# EasyEDA Pro project 蓝牙小车.eprj

# Schematic Schematic1
Board Name: Board1; Create Date: 2025-12-05; Page Name: P1; Project Name: 蓝牙小车; Schematic Name: Schematic1; Update Date: 2026-01-07; Company: 嘉立创EDA; Page Size: A4; Version: V1.0
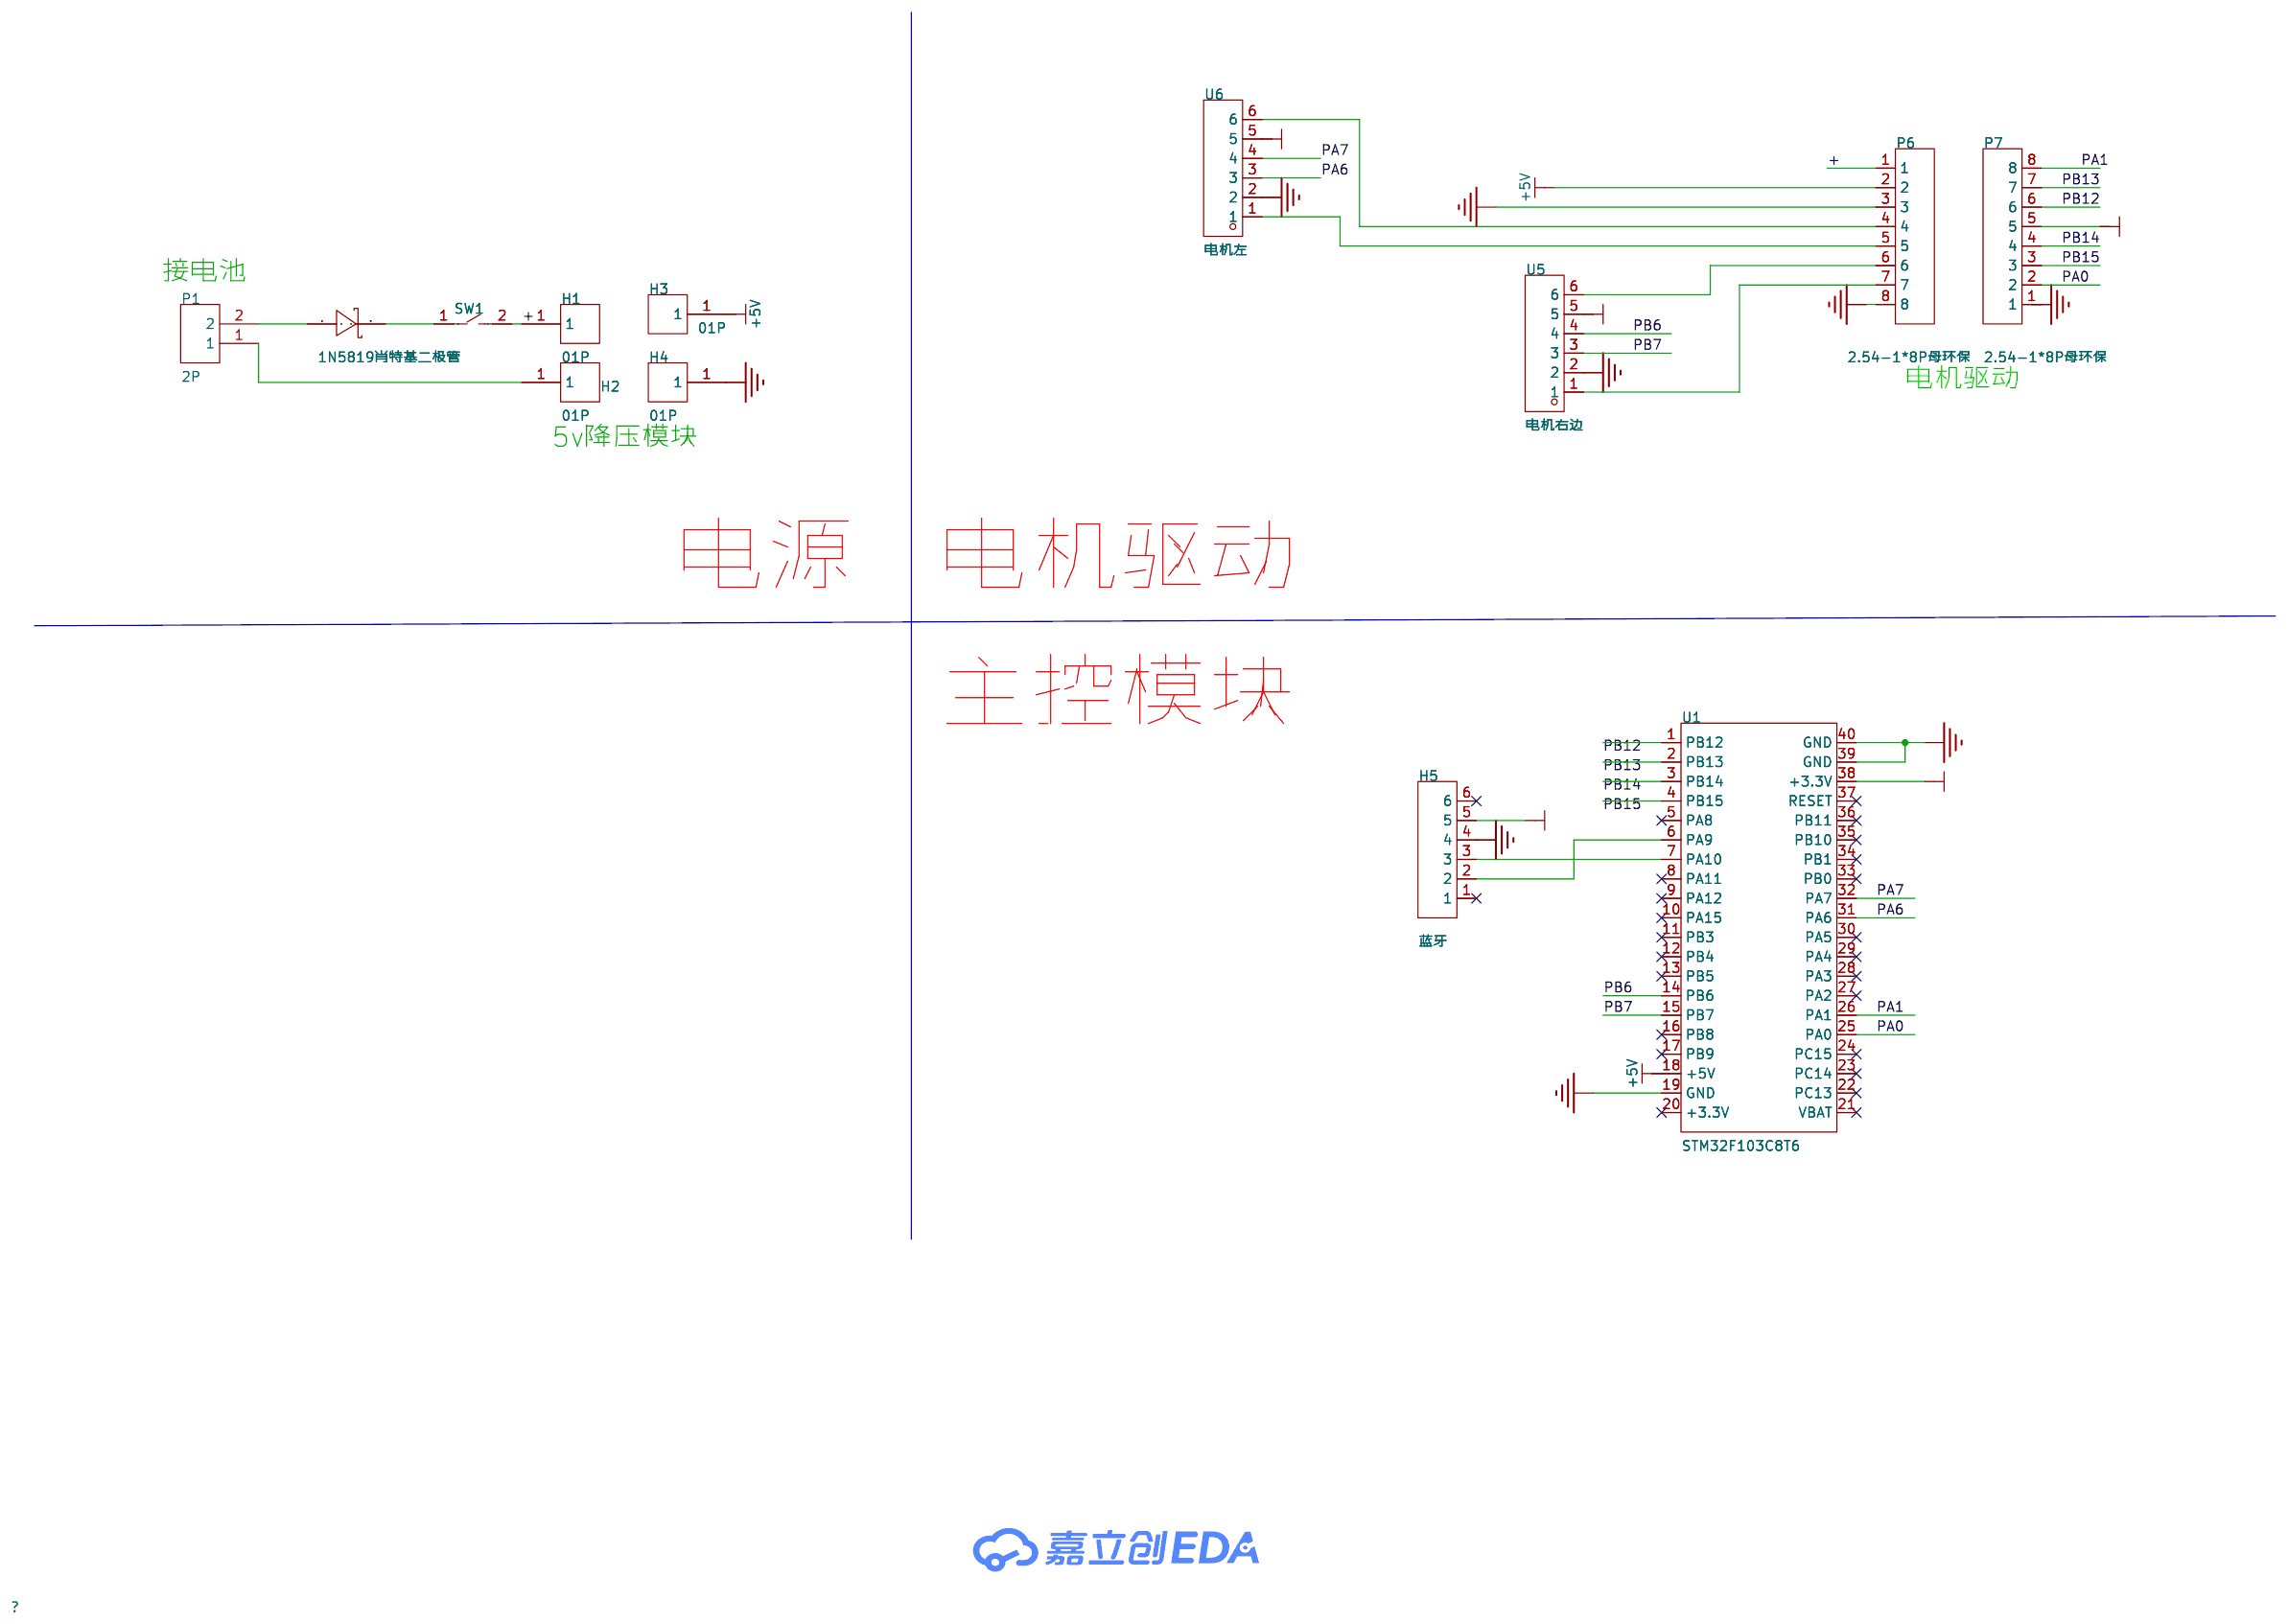
[diagram p0: schematic sheet]

## Parts
D1  1N5819肖特基二极管  [DO-41_BD2.4-L4.7-P8.70-D0.9-FD]
H1  01P  [HDR-TH_1P-P2.54-V-M]
H2  01P  [HDR-TH_1P-P2.54-V-M]
H3  01P  [HDR-TH_1P-P2.54-V-M]
H4  01P  [HDR-TH_1P-P2.54-V-M]
H5  蓝牙  [HDR-TH_6P-P2.54-H-F-W10.2]
P1  2P  [CONN-TH_2P-P5.00_WJ500V-5.08-2P]
P6  2.54-1*8P母环保  [HDR-TH_8P-P2.54-V-F_2]
P7  2.54-1*8P母环保  [HDR-TH_8P-P2.54-V-F_2]
SW1  HX KCD11-2P-R  [SW-TH_2P-L15.0-W10.5-P5.00_KCD11-2P-R]
U1  STM32F103C8T6  [CONN-TH_L53.3-W22.9_STM32F103C8T6-CARD]
U5  电机右边  [CONN-TH_6P-P2.50_ZX-XH2.54-6PWZ]
U6  电机左  [CONN-TH_6P-P2.50_ZX-XH2.54-6PWZ]

## Library data of the parts
D1 = 1N5819_C110032: LCSC Part Name: 电压:40V 电流:1A; Supplier Part: C110032; Manufacturer: ST(意法半导体); Supplier Footprint: DO-41; JLCPCB Part Class: 扩展库; Datasheet: https://item.szlcsc.com/datasheet/1N5819/111253.html; Supplier: LCSC; Voltage - Forward(Vf@If): 550mV@1A; Voltage - DC Reverse(Vr): 40V; Current - Rectified: 1A; Reverse Leakage Current (Ir): 500uA@40V; Non-Repetitive Peak Forward Surge Current: 25A
H1-H4 = PZ254V-11-01P: LCSC Part Name: 1x1P 间距:2.54mm 方针 直插; Supplier Part: C492400; Manufacturer: XFCN(兴飞); Supplier Footprint: 插件,P=2.54mm; JLCPCB Part Class: 扩展库; Datasheet: https://item.szlcsc.com/datasheet/PZ254V-11-01P/502956.html; Supplier: LCSC; Pin Structure: 1x1P; Pitch: 2.54mm; Circluar Pins/Square Pins: 方针; Mounting Type: 直插; Number of Rows: 单排; Number of Pins: 1P; Length of Mating Pin: 6mm; Insulation Height: 2.5mm; Length of End Connection Pin: 3mm; Contact Material: 黄铜; Operating Temperature: -40℃~+105℃; Color: 黑色
H5 = 2.54-1x6P WZPM: LCSC Part Name: 1x6P 间距:2.54mm 弯插; Supplier Part: C51018241; Manufacturer: SHOU HAN(首韩); Supplier Footprint: 弯插,P=2.54mm; JLCPCB Part Class: 扩展库; Datasheet: https://item.szlcsc.com/datasheet/2.54-1x6P%2520WZPM/53661126.html; Supplier: LCSC; Holes Structure: 1x6P; Pitch: 2.54mm; Circular Hole / Square Hole: 方孔; Mounting Type: 弯插; Number of Rows: 单排; Number of Positions: 6P; Current Rating: 3A; Holes Direction: 侧面; Contact Material: 黄铜; Contact Plating: 金; Operating Temperature: -40℃~+105℃
P1 = WJ500V-5.08-2P: LCSC Part Name: 1x2P 5.08mm 直插 排数:1 每排P数:2; Supplier Part: C8465; Manufacturer: KANGNEX(康奈克斯电气); Supplier Footprint: 插件,P=5.08mm; JLCPCB Part Class: 扩展库; Datasheet: https://atta.szlcsc.com/upload/public/pdf/source/20191225/C8465_02D34CE5B5B4A53DF5891601D97FA9F4.pdf; Supplier: LCSC; Structure: 1x2P; Pitch: 5.08mm; Color: 绿色; Mounting Style: 直插; Current Rating (Max): 18A; Voltage Rating (Max): 250V; Number of Rows: 1; Wire Gauge - AWG: 14~30; Wire Gauge - mm2: 2.5; Number of PINs Per Row: 2; Operating Temperature Range: -40℃~+105℃; Screw Specification: M2.5
P6 P7 = 2.54-1*8P母环保: LCSC Part Name: 1x8P 间距:2.54mm 直插; Supplier Part: C27438; Manufacturer: BOOMELE(博穆精密); Supplier Footprint: 插件,P=2.54mm; JLCPCB Part Class: 扩展库; Datasheet: https://item.szlcsc.com/datasheet/2.54-1*8P%25E6%25AF%258D%25E7%258E%25AF%25E4%25BF%259D/28187.html; Supplier: LCSC; Holes Structure: 1x8P; Pitch: 2.54mm; Circular Hole / Square Hole: 方孔; Mounting Type: 直插; Number of Rows: 单排; Number of Positions: 8P; Current Rating: 3A; Holes Direction: 顶部; Insulation Height: 8.5mm; Contact Material: 黄铜; Contact Plating: 金; Operating Temperature: -55℃~+105℃; PIN Length: 3.2mm
SW1 = HX KCD11-2P-R: LCSC Part Name: 10.5*15mm 两脚两档跷板开关 红钮; Supplier Part: C6917318; Manufacturer: hanxia(韩下); Supplier Footprint: 插件; JLCPCB Part Class: 扩展库; Datasheet: https://item.szlcsc.com/datasheet/HX%2520KCD11-2P-R/7881930.html; Supplier: LCSC; With Lamp: 无; Termination Style: 焊片; Actuator Color: 红色; Current Rating: 3A; Voltage Rating (AC): 250V; Circuit: 单刀单掷; Life: 1万次
U1 = LCKFB-DKX-STM32F103C8T6: LCSC Part Name: 立创·地阔星-STM32F103C8T6开发板; Supplier Part: C22396880; Manufacturer: 立创开发板; JLCPCB Part Class: 扩展库; Datasheet: https://item.szlcsc.com/datasheet/LCKFB-DKX-STM32F103C8T6/24005615.html; Supplier: LCSC
U5 U6 = ZX-XH2.54-6PWZ: LCSC Part Name: 1x6P 间距:2.5mm 弯插 系列:XH; Supplier Part: C7429645; Manufacturer: Megastar(兆星); Supplier Footprint: 弯插,P=2.5mm; JLCPCB Part Class: 扩展库; Datasheet: https://item.szlcsc.com/datasheet/ZX-XH2.54-6PWZ/8427562.html; Supplier: LCSC; Pins Structure: 1x6P; Pitch: 2.5mm; Mounting Type: 弯插; Reference Series: XH; Number of Pins: 6P; Number of Rows: 1; Number of PINs Per Row: 6; Current Rating: 2A; Contact Material: 黄铜; Contact Plating: 锡; Operating Temperature: -25℃~+85℃; Voltage Rating: 250V; Plastic Material: PA66; Flame Retardant Rating: UL94V-0; Color: 白色; Z-Height of the Board: 5.9mm; X-Length of Bottom Edge on Board (Spacing Line): 17.5mm; Y-Width of Bottom Edge on Board: 7.32mm

## Nets
3.3V: H5.5 P7.5 U1.38(+3.3V) U5.5 U6.5
+5V: H3.1 P6.2 U1.18(+5V)
GND: H4.1 H5.4 P6.3 P6.8 P7.1 U1.19(GND) U1.39(GND) U1.40(GND) U5.2 U6.2
+: H1.1 P6.1 SW1.2
PA0: P7.2 U1.25(PA0)
PA1: P7.8 U1.26(PA1)
PA6: U1.31(PA6) U6.3
PA7: U1.32(PA7) U6.4
PB6: U1.14(PB6) U5.4
PB7: U1.15(PB7) U5.3
PB12: P7.6 U1.1(PB12)
PB13: P7.7 U1.2(PB13)
PB14: P7.4 U1.3(PB14)
PB15: P7.3 U1.4(PB15)
$1N1126: H2.1 P1.1
$1N5775: P6.4 U6.6
$1N5781: P6.5 U6.1
$1N5788: P6.6 U5.6
$1N5794: P6.7 U5.1
$1N6078: H5.3 U1.7(PA10)
$1N6242: H5.2 U1.6(PA9)
$1N7964: D1.1(A) P1.2
$1N10273: D1.2(K) SW1.1

Not connected (* = marked no-connect by the designer): H5 1* 6*; U1 5(PA8)* 8(PA11)* 9(PA12)* 10(PA15)* 11(PB3)* 12(PB4)* 13(PB5)* 16(PB8)* 17(PB9)* 20(+3.3V)* 21(VBAT)* 22(PC13)* 23(PC14)* 24(PC15)* 27(PA2)* 28(PA3)* 29(PA4)* 30(PA5)* 33(PB0)* 34(PB1)* 35(PB10)* 36(PB11)* 37(RESET)*

## Notes on the sheet
- 接电池
- 电机驱动
- 5v降压模块
- 电源
- 电机驱动
- 主控模块

# Board PCB1
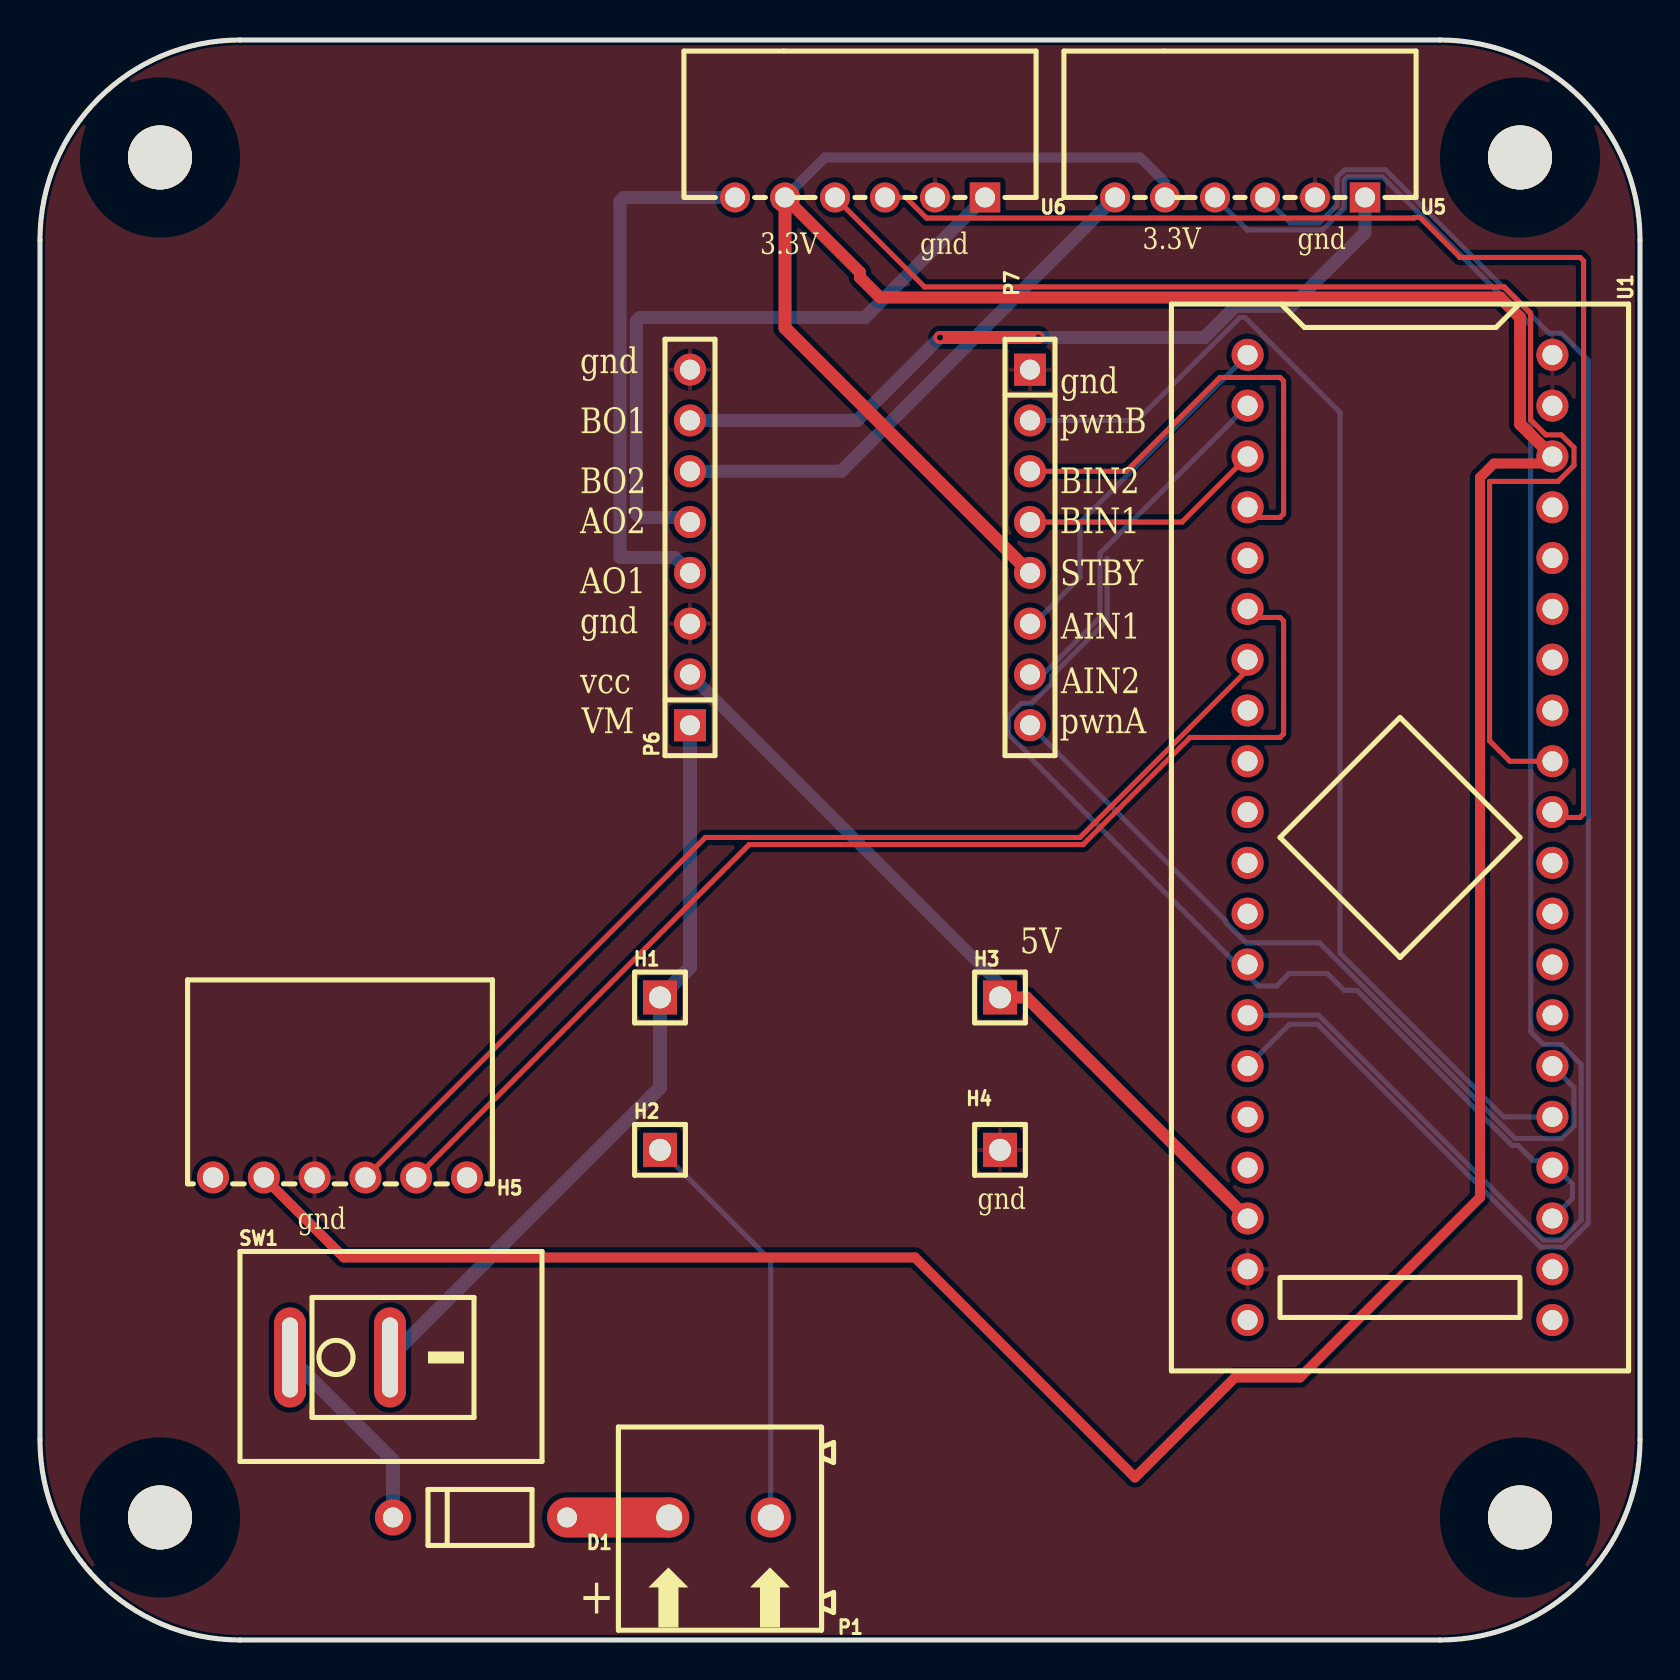
[diagram p1: board, top side]
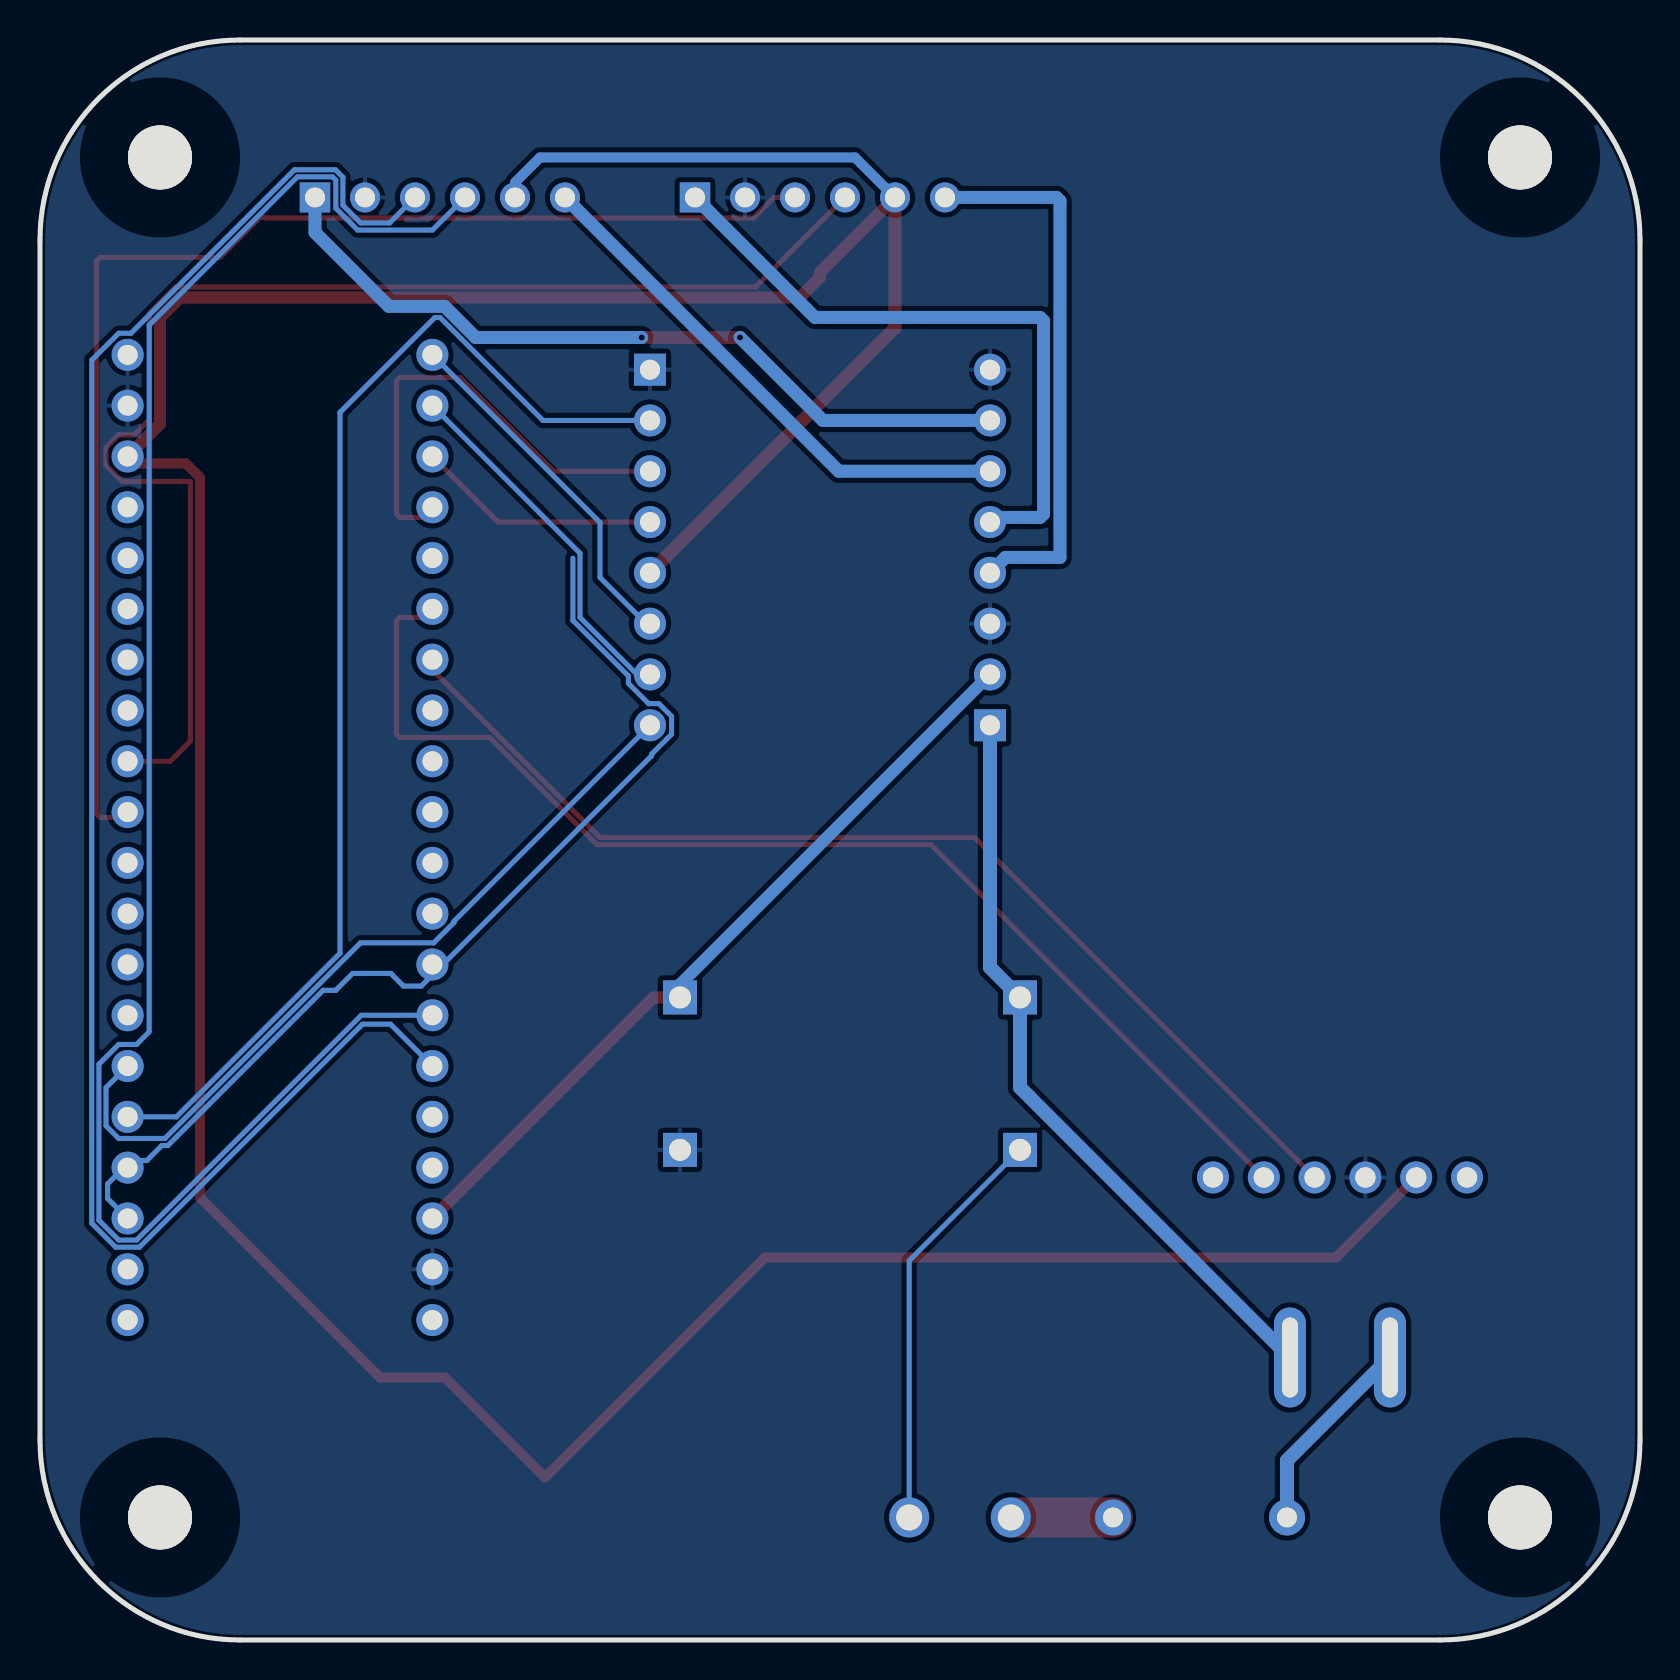
[diagram p2: board, bottom side, seen from below]

Outline 80 x 80 mm; copper layers: Top Layer, Bottom Layer. Coordinates in mm from the lower left corner of the outline.
Outline path: 0,70 0,10 arc(2.93,2.93) 10,0 70,0 arc(77.07,2.93) 80,10 80,70 arc(77.07,77.07) 70,80 10,80 arc(2.93,77.07) 0,70
Stack: Top Layer 0.035mm / Dielectric1 1.51mm FR4 er 4.5 / Bottom Layer 0.035mm

## Design rules (mm)
template: JLCPCB Capability(Two Layers Board)
spacing copperThickness1oz (default): track to track 0.102, other pairs 0.152 to 0.3
spacing copperThickness2oz: track to track 0.203, other pairs 0.152 to 0.3
track width copperThickness1oz (default): min 0.127, default 0.254, max 2.54
track width copperThickness2oz: min 0.203, default 0.254, max 2.54
differential pair differentialPair (default): width min 0.127, default 0.254, max 2.54; gap min 0.152, default 0.152
via viaSize (default): diameter min 0.5, default 0.61, max 10; hole min 0.3, default 0.305, max 6.3

## Placement (name value [footprint] x y rotation side)
D1  1N5819肖特基二极管  [DO-41_BD2.4-L4.7-P8.70-D0.9-FD]  22 6.13 180 top
H1  01P  [HDR-TH_1P-P2.54-V-M]  31 32.13 0 top
H2  01P  [HDR-TH_1P-P2.54-V-M]  31 24.51 0 top
H3  01P  [HDR-TH_1P-P2.54-V-M]  48 32.13 0 top
H4  01P  [HDR-TH_1P-P2.54-V-M]  48 24.51 0 top
H5  蓝牙  [HDR-TH_6P-P2.54-H-F-W10.2]  15 23.13 180 top
NOREF  -  [Pad_e13]  6 74.13 0 top
NOREF#2  -  [Pad_e22]  74 74.13 0 top
NOREF#3  -  [Pad_e23]  6 6.13 0 top
NOREF#4  -  [Pad_e24]  74 6.13 0 top
P1  2P  [CONN-TH_2P-P5.00_WJ500V-5.08-2P]  34 6.13 180 top
P6  2.54-1*8P母环保  [HDR-TH_8P-P2.54-V-F_2]  32.5 54.63 90 top
P7  2.54-1*8P母环保  [HDR-TH_8P-P2.54-V-F_2]  49.5 54.63 270 top
SW1  HX KCD11-2P-R  [SW-TH_2P-L15.0-W10.5-P5.00_KCD11-2P-R]  15 14.13 0 top
U1  STM32F103C8T6  [CONN-TH_L53.3-W22.9_STM32F103C8T6-CARD]  68 40.13 270 top
U5  电机右边  [CONN-TH_6P-P2.50_ZX-XH2.54-6PWZ]  60 72.13 180 top
U6  电机左  [CONN-TH_6P-P2.50_ZX-XH2.54-6PWZ]  41 72.13 180 top

## Footprints (pads in the part's own frame, mm; a bottom-side part is the same pattern mirrored in y, then rotated)
CONN-TH_2P-P5.00_WJ500V-5.08-2P
  round 2 hole 1.3: 1(-2.54,0) 2(2.54,0)
CONN-TH_6P-P2.50_ZX-XH2.54-6PWZ
  rect 1.524x1.5 hole 1: 1(-6.25,0)
  round 1.5 hole 1: 2(-3.75,0) 3(-1.25,0) 4(1.25,0) 5(3.75,0) 6(6.25,0)
CONN-TH_L53.3-W22.9_STM32F103C8T6-CARD
  round 1.6 hole 1: 1(-24.13,-7.62) 2(-21.59,-7.62) 3(-19.05,-7.62) 4(-16.51,-7.62) 5(-13.97,-7.62) 6(-11.43,-7.62) 7(-8.89,-7.62) 8(-6.35,-7.62) 9(-3.81,-7.62) 10(-1.27,-7.62) 11(1.27,-7.62) 12(3.81,-7.62) 13(6.35,-7.62) 14(8.89,-7.62) 15(11.43,-7.62) 16(13.97,-7.62) 17(16.51,-7.62) 18(19.05,-7.62) 19(21.59,-7.62) 20(24.13,-7.62) 21(24.13,7.62) 22(21.59,7.62) 23(19.05,7.62) 24(16.51,7.62) 25(13.97,7.62) 26(11.43,7.62) 27(8.89,7.62) 28(6.35,7.62) 29(3.81,7.62) 30(1.27,7.62) 31(-1.27,7.62) 32(-3.81,7.62) 33(-6.35,7.62) 34(-8.89,7.62) 35(-11.43,7.62) 36(-13.97,7.62) 37(-16.51,7.62) 38(-19.05,7.62) 39(-21.59,7.62) 40(-24.13,7.62)
DO-41_BD2.4-L4.7-P8.70-D0.9-FD
  round 1.8 hole 1: 1(-4.35,0) 2(4.35,0)
HDR-TH_1P-P2.54-V-M
  rect 1.7x1.7 hole 1.1: 1(0,0)
HDR-TH_6P-P2.54-H-F-W10.2
  round 1.6 hole 1.02: 1(-6.35,0) 2(-3.81,0) 3(-1.27,0) 4(1.27,0) 5(3.81,0) 6(6.35,0)
HDR-TH_8P-P2.54-V-F_2
  rect 1.6x1.6 hole 1: 1(-8.89,0)
  round 1.6 hole 1: 2(-6.35,0) 3(-3.81,0) 4(-1.27,0) 5(1.27,0) 6(3.81,0) 7(6.35,0) 8(8.89,0)
Pad_e13
  round 3.2 hole 3.2: 1(0,0)
Pad_e22
  round 3.2 hole 3.2: 2(0,0)
Pad_e23
  round 3.2 hole 3.2: 3(0,0)
Pad_e24
  round 3.2 hole 3.2: 4(0,0)
SW-TH_2P-L15.0-W10.5-P5.00_KCD11-2P-R
  oval 1.6x5 hole 0.8x4: 1(-2.5,0) 2(2.5,0)

## Nets
As in the schematic.

Pads without a net: H5 1 6; NOREF 1; NOREF#2 2; NOREF#3 3; NOREF#4 4; U1 5 8 9 10 11 12 13 16 17 20 21 22 23 24 27 28 29 30 33 34 35 36 37

## Via types
v1: diameter 0.61, hole 0.305, Top Layer to Bottom Layer, 2 vias

## Routing (per net, layer and track width the routed paths; a pad name or vN(x,y) marks a point on that pad's centre or on a via; arc(x,y) is an arc through that point)
3.3V: length 204.8
  Top Layer w0.5: H5.5 15.19,19.13 43.75,19.13 54.75,8.13 59.75,13.13 63,13.13 72,22.13 72,58.13 72.7,58.82 75.27,58.82 U1.38
  Top Layer w0.6: U1.38 74,60.8 74,66.12 73,67.13 42,67.13 41,68.13 41,68.38 U6.5
  Top Layer w0.65: P7.5 37.25,65.61 U6.5
  Bottom Layer w0.5: U5.5 56.25,72.88 55,74.13 39.25,74.13 U6.5
+5V: length 39.5
  Top Layer w0.6: U1.18 49.33,32.13 H3.1
  Bottom Layer w0.6: H3.1 48,32.78 P6.2
(no net): length 51.4
  Bottom Layer w0.254: U1.23 76.62,22.08 76.62,22.8 75.45,23.97 74.66,23.97 73.91,24.72 73.61,24.72 65.85,32.48 65.21,32.48 64.37,33.33 62.46,33.33 61.83,32.7 60.93,32.7 49.42,44.21 49.42,44.29 48.42,45.29 48.42,46.18 49.05,46.82 49.56,46.82 50.58,47.83 50.58,48.2 53.36,50.98 53.36,54.09
+: length 37.8
  Bottom Layer w0.7: P6.1 32.5,33.63 H1.1 31,27.63 SW1.2
PA0: length 60.7
  Bottom Layer w0.254: P7.2 54.85,60.98 60,66.13 60.25,66.13 65,61.38 65,34.34 73.18,26.16 U1.25
PA1: length 39.5
  Bottom Layer w0.254: P7.8 59.3,35.94 59.3,35.87 60.31,34.86 63.98,34.86 73.75,25.08 76.07,25.08 76.7,25.71 76.7,27.62 U1.26
PA6: length 65.7
  Top Layer w0.254: U1.31 75.89,41.13 77,41.13 77.18,41.31 77.18,68.95 77,69.13 71,69.13 69,71.13 68.73,71.13 68.7,71.1 44.32,71.1 43.29,72.13 U6.3
PA7: length 67.2
  Top Layer w0.254: U1.32 73.5,43.94 72.48,44.95 72.48,57.93 75.9,57.93 76.7,58.73 76.7,59.62 76.07,60.26 75.29,60.26 74.53,61.01 74.53,66.34 73.22,67.65 44.22,67.65 U6.4
PB6: length 89.5
  Bottom Layer w0.254: U5.4 60.38,70.5 64.12,70.5 65.21,71.59 65.21,72.99 65.37,73.16 67.13,73.16 74.54,65.74 74.54,30.41 75.17,29.78 76.07,29.78 77.06,28.79 77.06,20.99 76.07,20 75.17,20 63.93,31.24 U1.14
PB7: length 88.7
  Bottom Layer w0.254: U5.3 62.52,70.85 63.97,70.85 64.85,71.74 64.85,73.14 65.22,73.51 67.28,73.51 75.45,65.34 76.07,65.34 77.41,63.99 77.41,20.84 76.21,19.64 75.03,19.64 63.88,30.79 62.47,30.79 U1.15
PB12: length 18.1
  Bottom Layer w0.254: U1.1 52,55.88 52,53.13 49.69,50.82 P7.6
PB13: length 18.3
  Bottom Layer w0.254: P7.7 50.15,48.28 53,51.13 53,54.34 U1.2
PB14: length 12.2
  Top Layer w0.254: P7.4 57.1,55.9 U1.3
PB15: length 23.4
  Top Layer w0.254: P7.3 54.31,58.44 59,63.13 62,63.13 62.18,62.95 62.18,56.31 62,56.13 60.89,56.13 U1.4
$1N1126: length 20.7
  Bottom Layer w0.254: H2.1 36.54,18.97 P1.1
$1N5775: length 27.5
  Bottom Layer w0.65: P6.4 31.73,54.13 29,54.13 29,71.95 29.18,72.13 U6.6
$1N5781: length 32.5
  Bottom Layer w0.65: P6.5 32.27,56.13 30,56.13 29.82,56.31 29.82,65.95 30,66.13 41.25,66.13 U6.1
$1N5788: length 26.9
  Bottom Layer w0.65: U5.6 40.06,58.44 P6.6
$1N5794: length 39.4
  Top Layer w0.65: v1(49.92,65.13) 45,65.13 v1(45,65.13)
  Bottom Layer w0.65: v1(49.92,65.13) 58.21,65.13 59.77,66.68 62.55,66.68 66.25,70.38 U5.1 ; v1(45,65.13) 40.85,60.98 P6.7
$1N6078: length 55.1
  Top Layer w0.254: U1.7 60.38,48.51 52,40.13 33.27,40.13 H5.3
$1N6242: length 60.2
  Top Layer w0.254: U1.6 60.81,51.13 62,51.13 62.18,50.95 62.18,45.31 62,45.13 57.5,45.13 52.15,39.77 35.45,39.77 H5.2
$1N7964: length 5.1
  Top Layer w2: P1.2 D1.1
$1N10273: length 10.1
  Bottom Layer w0.7: D1.2 17.65,8.98 SW1.1

## Copper pours and planes (outline as drawn; the poured copper is in the pictures)
GND on Top Layer: -5,86.13 85,86.13 85,-5.87 -5,-5.87
GND on Bottom Layer: -4,83.13 83,83.13 83,-2.87 -4,-2.87

## Text on the board
Top Silkscreen Layer: gnd | 3.3V | BO1 | BO2 | AO2 | AO1 | vcc | VM | 5V | pwnB | pwnA | BIN2 | BIN1 | STBY | AIN1 | AIN2 | +
